# EAGLE design Grove -Mini Camera v1.0 (EAGLE 6.3)
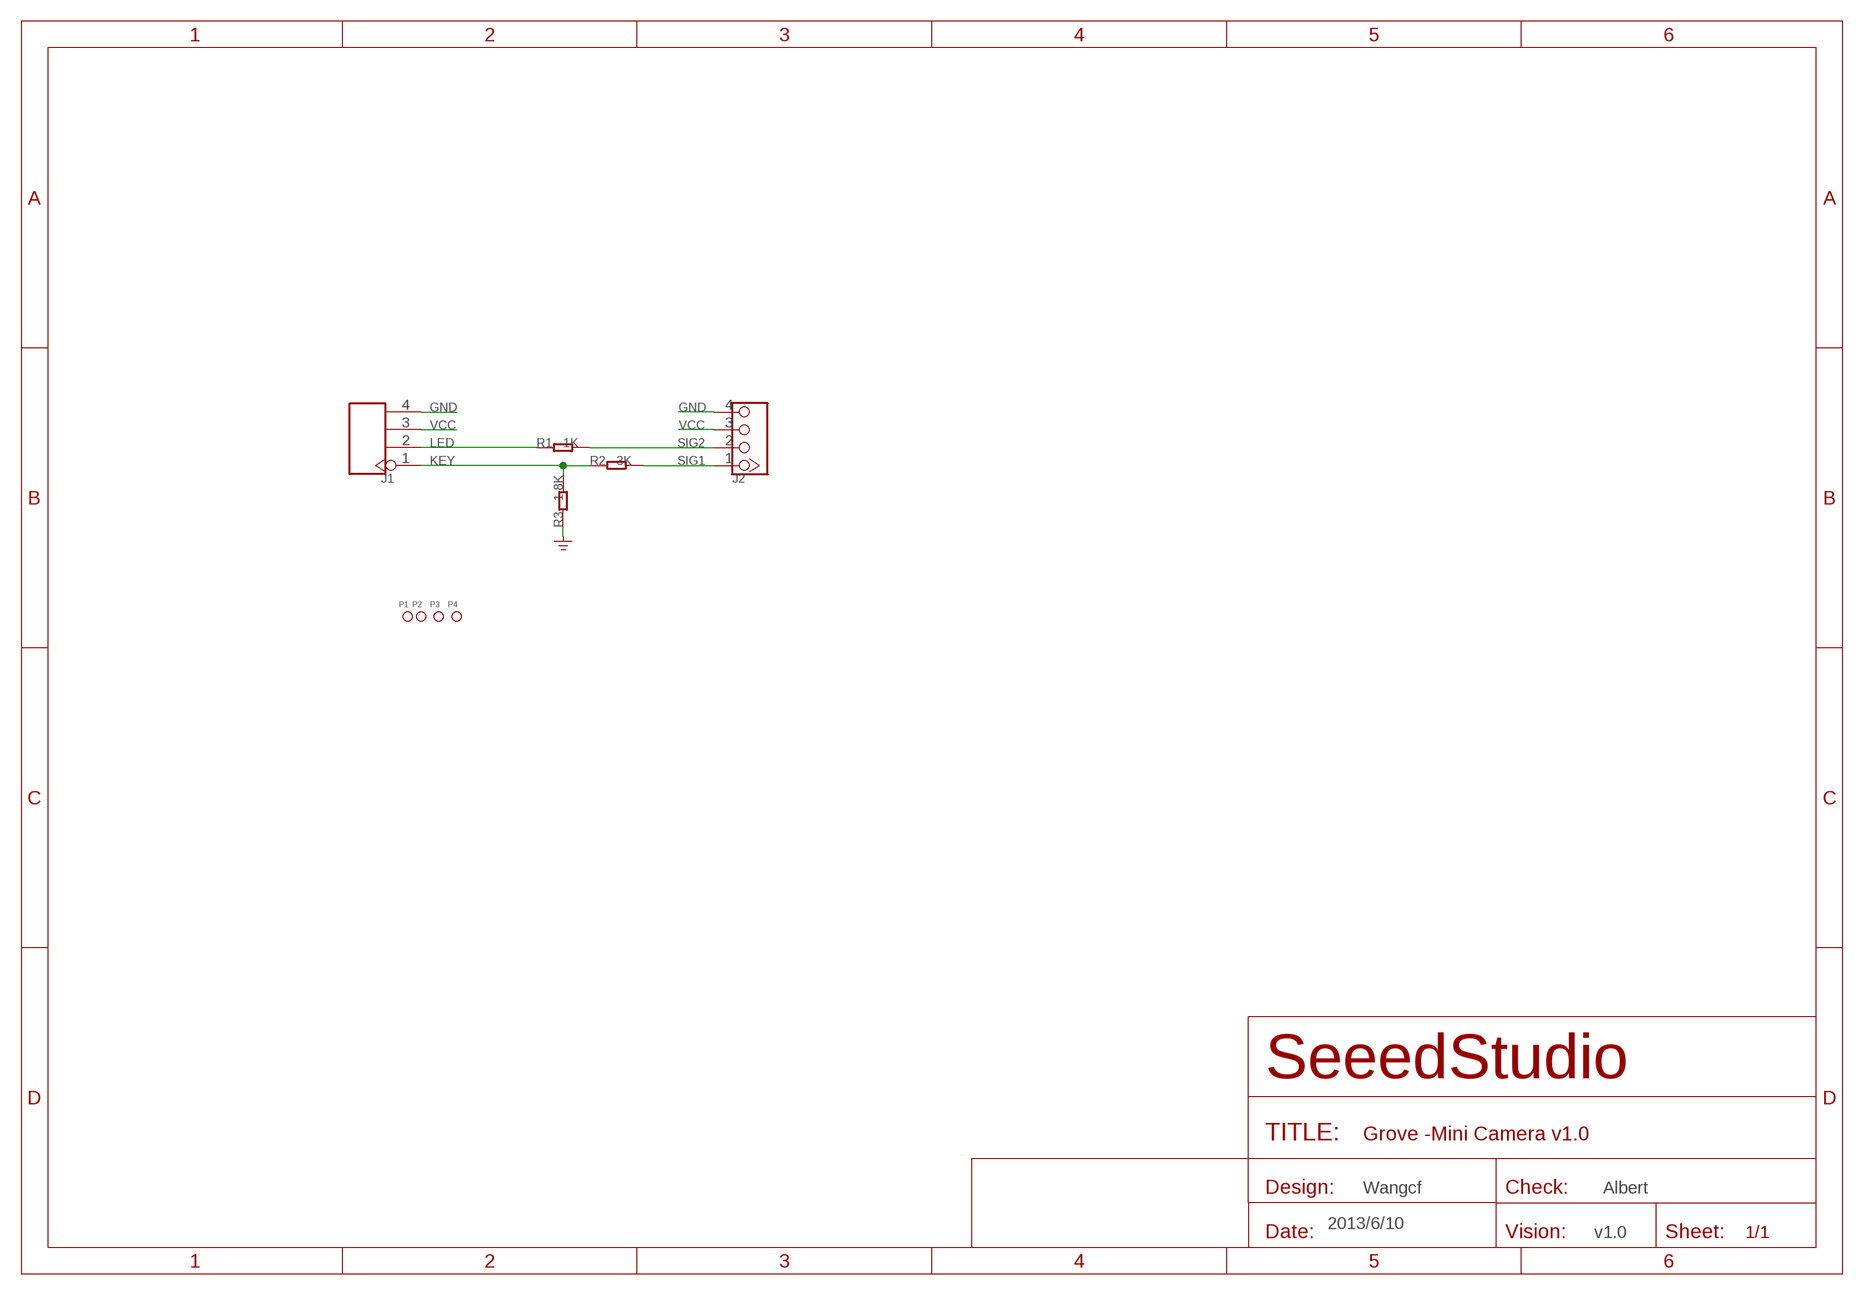
[diagram p0: schematic, sheet 1]

## Parts
J1  HEADER-4P-65/35MIL  [4P-65/35MIL]
J2  TWIG-4P-2.0'90D'  [4P-2.0-90D]
P1  PAD-MARK  [ROUND-MARK-1.0]
P2  PAD-MARK  [ROUND-MARK-1.0]
P3  PAD-MARK  [ROUND-MARK-1.0]
P4  PAD-MARK  [ROUND-MARK-1.0]
R1  1K  R-0603  [R0603]
R2  3K  R-0603  [R0603]
R3  1.8K  R-0603  [R0603]

## Nets
GND: J1.4 J2.4 R3.1
KEY: J1.1 R2.1 R3.2
LED: J1.2 R1.1
SIG1: J2.1 R2.2
SIG2: J2.2 R1.2
VCC: J1.3 J2.3

## Notes on the sheet
- Wangcf | Albert
- 2013/6/10
- v1.0

## Library data of the parts
J1 = Connector:HEADER-4P
J2 = Connector:TWIG-4P-2.0
P1-P4 = Discrete:PAD-MARK; PARTNO: DNP
R1-R3 = Discrete:R*

## Net classes
0 default: width 0.152 mm, drill 0.152 mm, clearance 0.152 mm

## Board
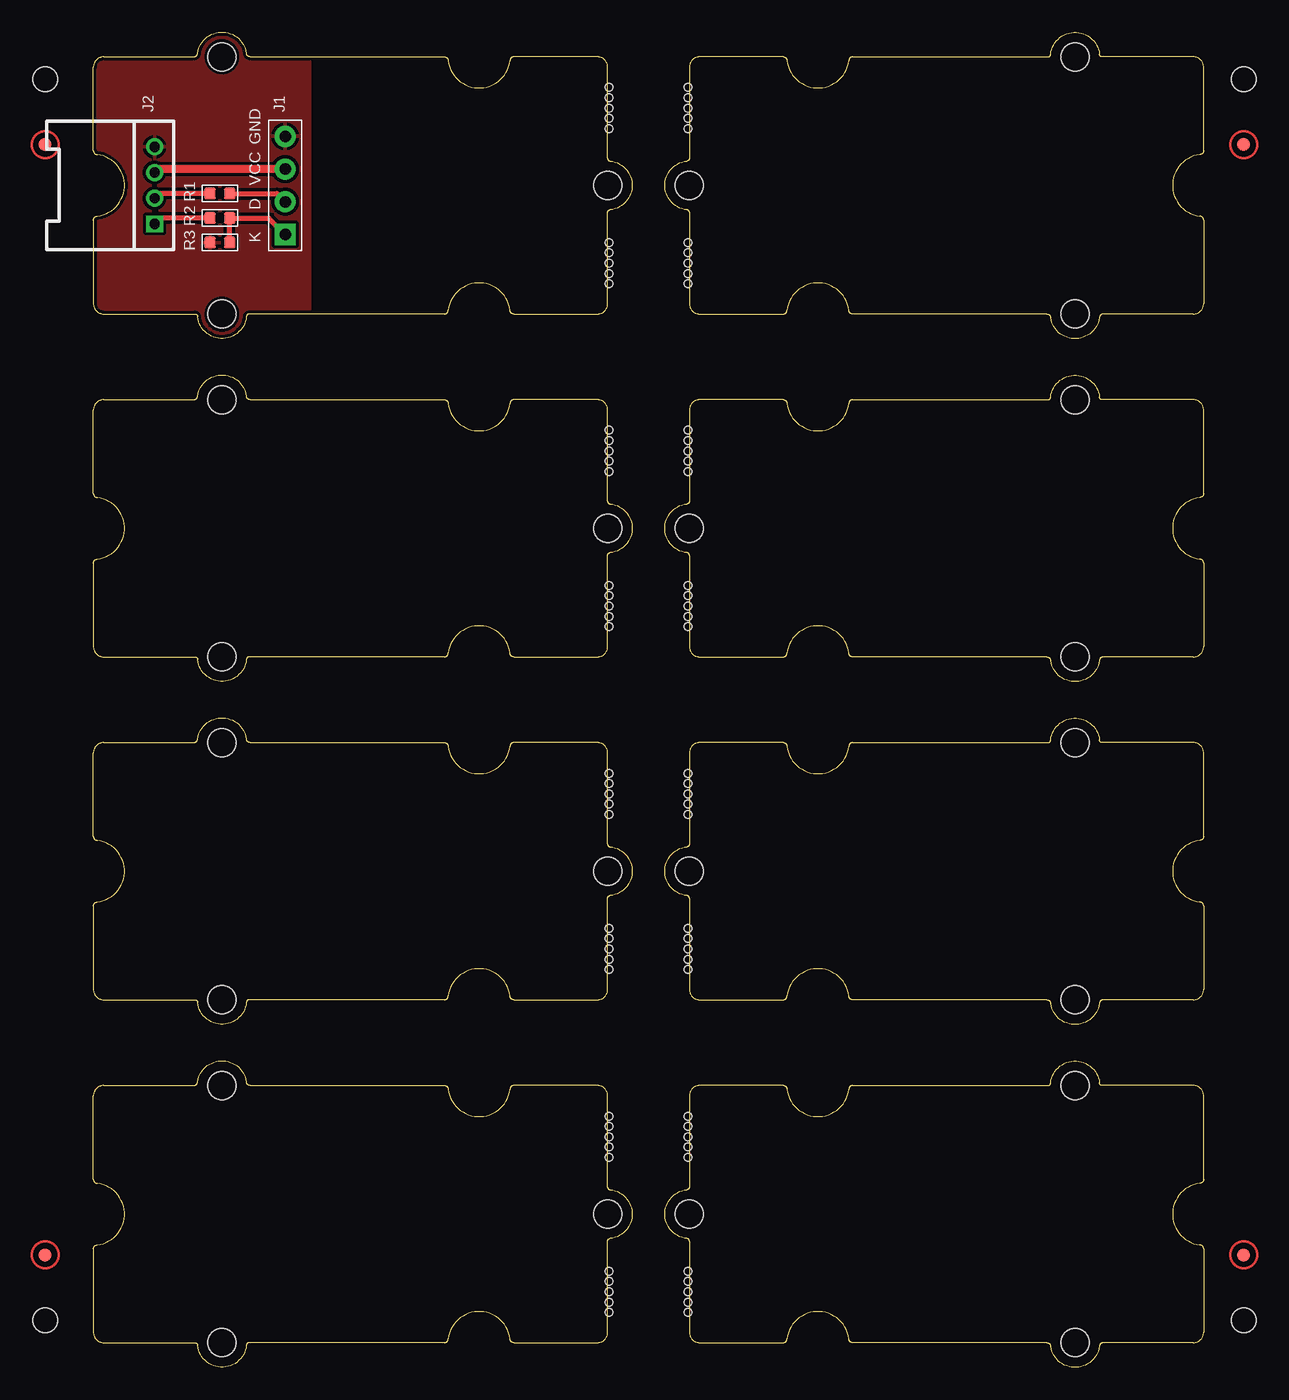
[diagram p1: board, top side]
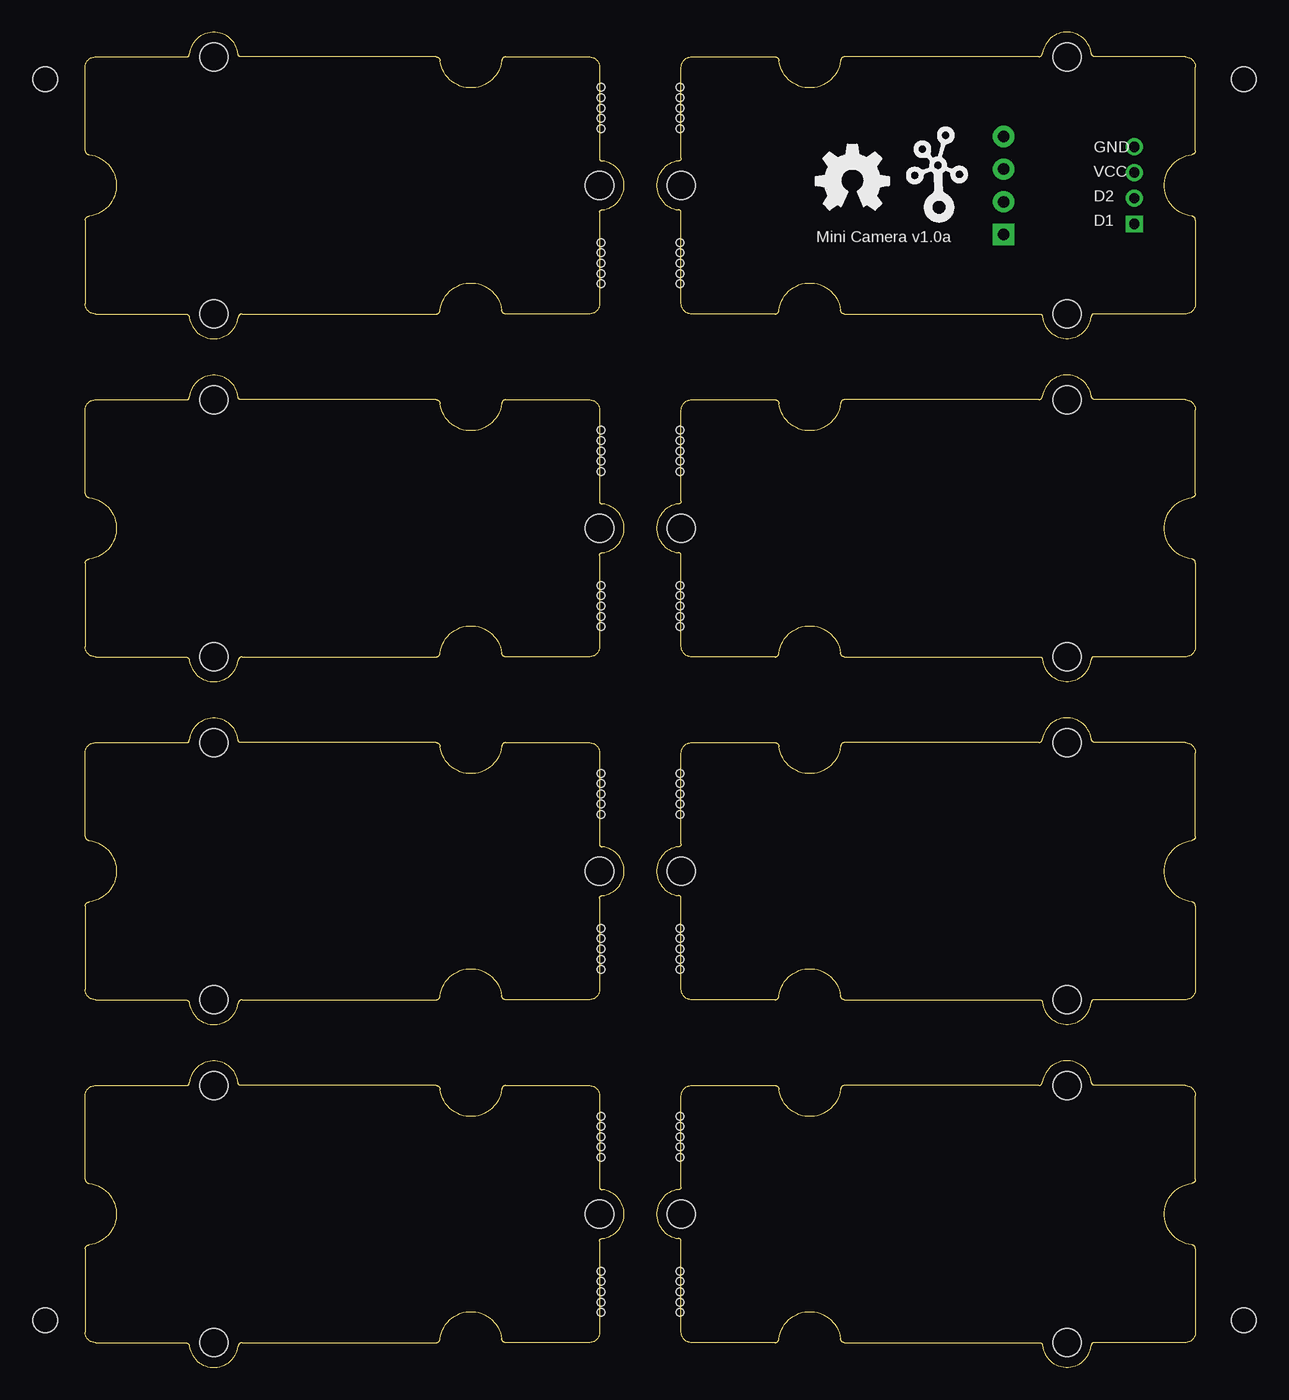
[diagram p2: board, bottom side, seen from below]

Size 86.35 x 103.85 mm. Coordinates in mm from the lower left corner, seen from the top.
Copper layers (1*16): Top 0.035mm / dielectric 1.5mm / Bottom 0.035mm
Design rules "SeeedStudio_DRU_no_angle_20130527": minimum track width 6mil, minimum drill 12mil, track to track 6mil, track to pad 6mil, pad to pad 6mil, via to via 6mil, smd to smd 0mil, copper to edge 10mil, drill to drill 10mil, minimum pad ring 10mil, minimum via ring 6mil, stop-mask expansion 2mil, vias tented up to drill 25mil, thermal gap 10mil
Holes 1.91 mm at -3.75,100.19 89.47,100.19 89.47,3.67 -3.75,3.67
Holes 0.6 mm at 46.25,99.55 46.25,98.75 46.25,97.95 46.25,97.15 46.25,96.35 40.11,99.55 40.11,98.75 40.11,97.95 40.11,97.15 40.11,96.35 46.25,87.49 46.25,86.69 46.25,85.89 46.25,85.09 46.25,84.29 40.11,87.49 40.11,86.69 40.11,85.89 40.11,85.09 40.11,84.29 46.25,72.88 46.25,72.08 46.25,71.28 46.25,70.48 46.25,69.68 40.11,72.88 40.11,72.08 40.11,71.28 40.11,70.48 40.11,69.68 46.25,60.82 46.25,60.02 46.25,59.22 46.25,58.42 46.25,57.62 40.11,60.82 40.11,60.02 40.11,59.22 40.11,58.42 40.11,57.62 46.25,46.21 46.25,45.41 46.25,44.61 46.25,43.81 46.25,43.01 40.11,46.21 40.11,45.41 40.11,44.61 40.11,43.81 40.11,43.01 46.25,34.15 46.25,33.35 46.25,32.55 46.25,31.75 46.25,30.95 40.11,34.15 40.11,33.35 40.11,32.55 40.11,31.75 40.11,30.95 46.25,19.54 46.25,18.74 46.25,17.94 46.25,17.14 46.25,16.34 40.11,19.54 40.11,18.74 40.11,17.94 40.11,17.14 40.11,16.34 46.25,7.48 46.25,6.68 46.25,5.88 46.25,5.08 46.25,4.28 40.11,7.48 40.11,6.68 40.11,5.88 40.11,5.08 40.11,4.28

### Footprints (pad centres in the part's own frame; a part is rotated, then mirrored left to right if it is on the bottom)
4P-65/35MIL = drill 0.889 pad 1.651 square: 1 0,3.81 | drill 0.889 pad 1.651: 2 0,1.27; 3 0,-1.27; 4 0,-3.81
4P-2.0-90D = drill 0.8 pad 1.27 square: 1 -3,0 | drill 0.8 pad 1.27: 2 -1,0; 3 1,0; 4 3,0
ROUND-MARK-1.0 = smd 1.016 x 1.016: P$1 0,0
R0603 = smd 0.889 x 0.889: 1 -0.762,0; 2 0.762,0
2U-DIM-W/DRILL = hole 2.2: -10,-10; -10,10; 20,0

### Placement (x,y rotation side)
J1  14.92,91.93 180 top
J2  4.76,91.93 90 top
P1  -3.75,8.75 0 top  (outside the outline)
P2  -3.75,95.11 0 top  (outside the outline)
P3  89.47,95.11 0 top  (outside the outline)
P4  89.47,8.75 0 top  (outside the outline)
R1  9.84,91.3 180 top
R2  9.84,89.39 180 top
R3  9.84,87.49 0 top
U$2  [OSHW_FILLX200_NOTEXT]  29.52,90.03 0 bottom
U$3  [TWIGLOGO]  20,90.03 0 bottom
U$5  [2U-DIM-W/DRILL]  20,91.93 0 top
U$6  [2U-DIM-W/DRILL]  66.35,91.93 180 top
U$7  [2U-DIM-W/DRILL]  20,65.26 0 top
U$8  [2U-DIM-W/DRILL]  20,38.59 0 top
U$9  [2U-DIM-W/DRILL]  20,11.92 0 top
U$10  [2U-DIM-W/DRILL]  66.35,11.92 180 top
U$11  [2U-DIM-W/DRILL]  66.35,38.59 180 top
U$12  [2U-DIM-W/DRILL]  66.35,65.26 180 top

### Tracks (layer width: path | path; a pad name or v marks a point on that pad's centre or on a via)
GND
  pour Top (isolate 0.254): -0.32,79.23 16.82,79.23 16.82,104 -0.32,104 -0.32,79.49
KEY
  Top 0.406: J1.1 13.65,89.39 R2.1 R3.2
LED
  Top 0.406: R1.1 14.29,91.3 J1.2
SIG1
  Top 0.406: R2.2 5.22,89.39 J2.1
SIG2
  Top 0.406: R1.2 5.12,91.3 J2.2
VCC
  Top 0.61: J1.3 5.03,93.2 J2.3

### Text on the board
tPlace: GND | VCC | D | K
bPlace: GND | VCC | D2 | D1 | Mini Camera v1.0a